# Altium schematic sheet eth_10base-t1s_phy.SchDoc
size B
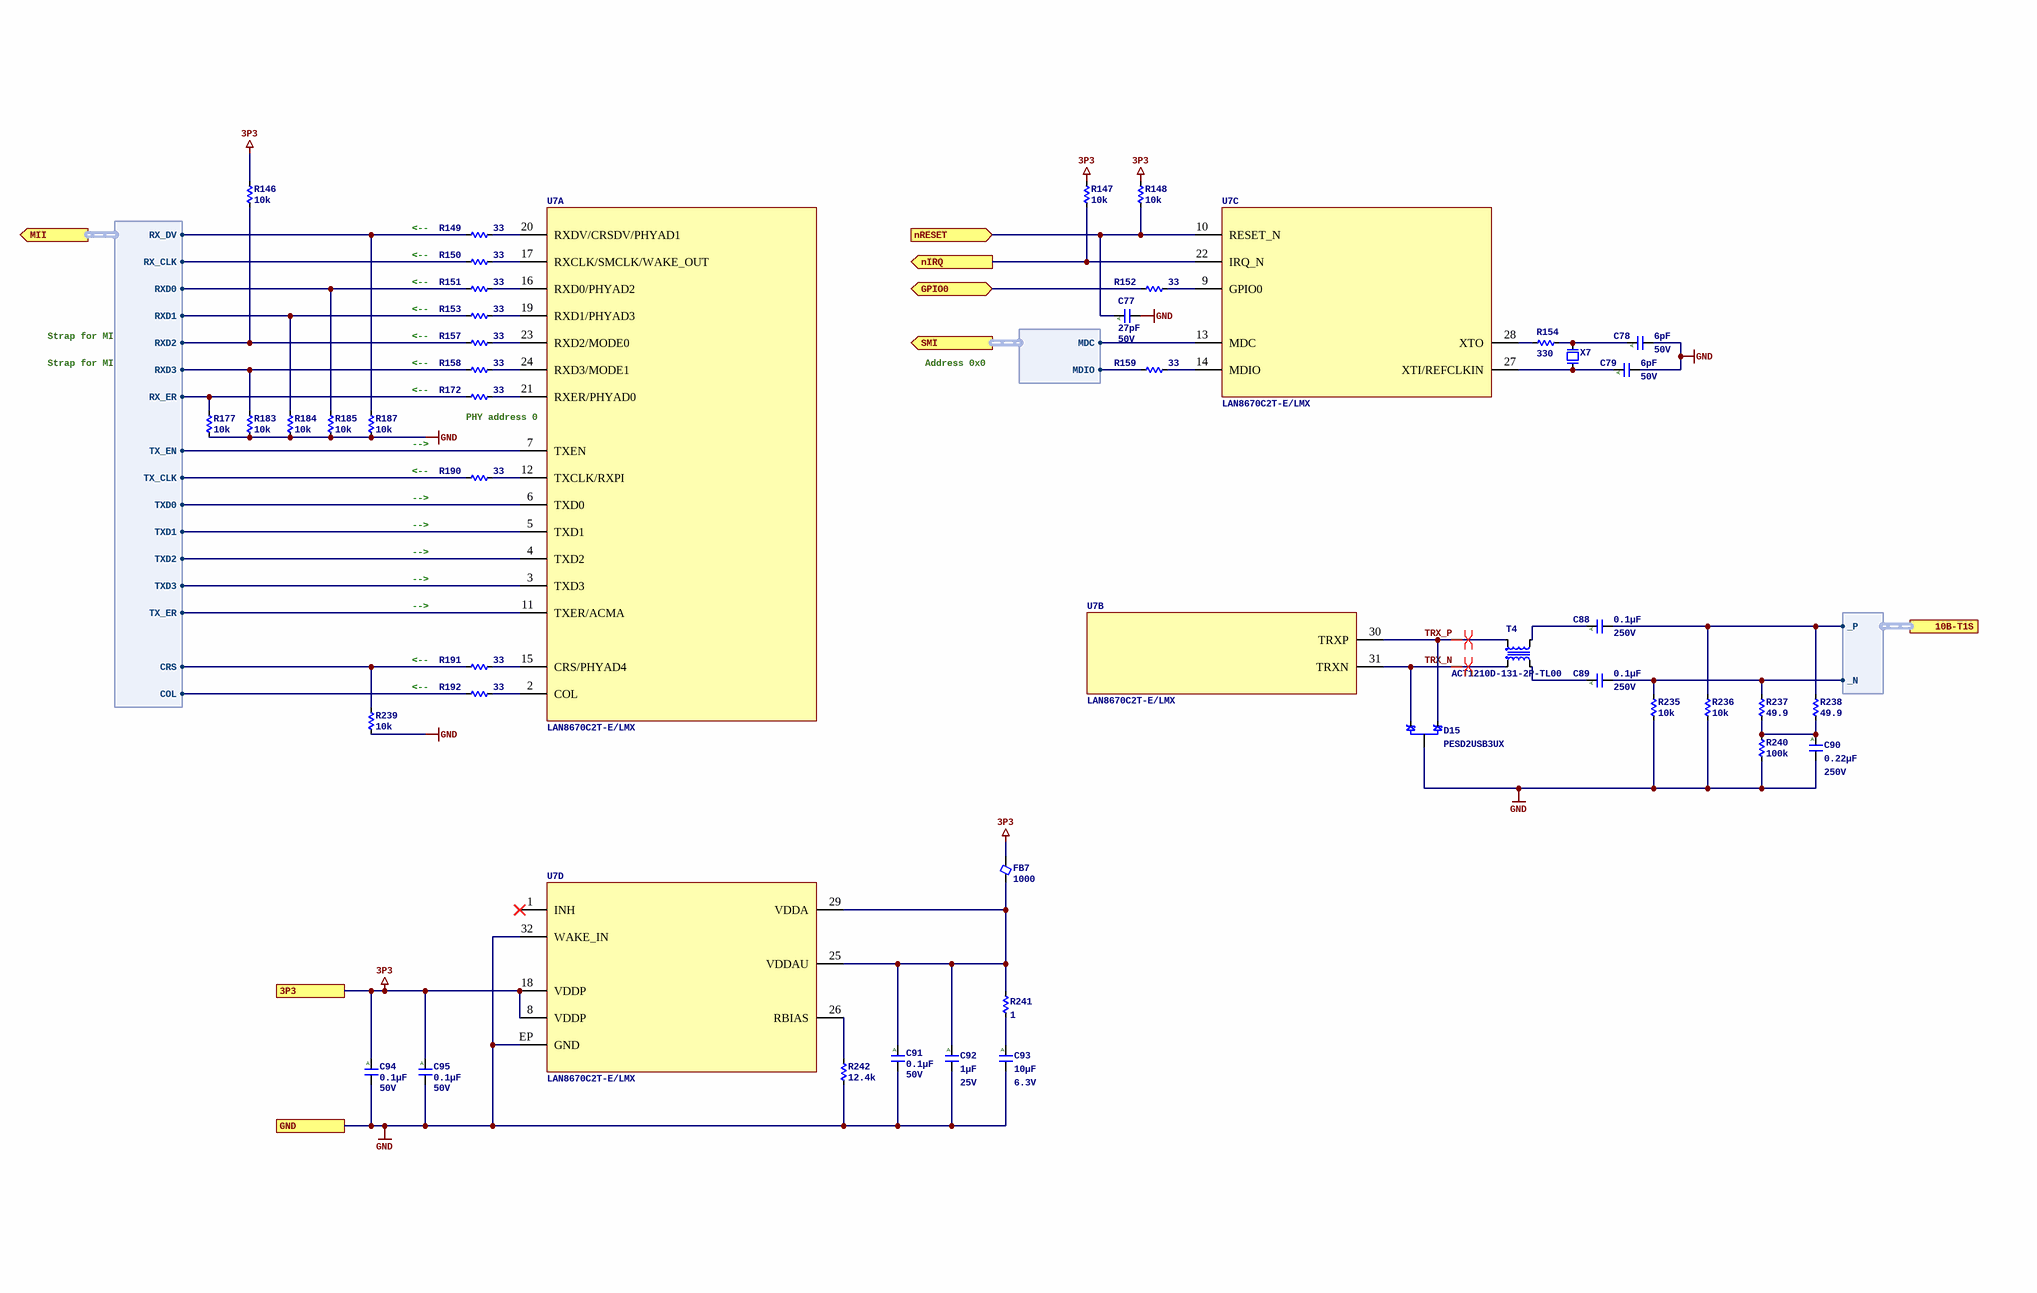
[diagram p0: eth_10base-t1s_phy.SchDoc]

## Parts
C77  Capacitance: 27pF  Voltage - Rated: 50V  [C0402_0.55MM]  (hidden comment: CGA2B2C0G1H270J050BA)
C78  Capacitance: 6pF  Voltage - Rated: 50V  [C0402_0.55MM]  (hidden comment: CGA2B2C0G1H060D050BA)
C79  Capacitance: 6pF  Voltage - Rated: 50V  [C0402_0.55MM]  (hidden comment: CGA2B2C0G1H060D050BA)
C88  Capacitance: 0.1µF  Voltage - Rated: 250V  [C1206_1.80MM]  (hidden comment: CGA5L3X7R2E104K160AA)
C89  Capacitance: 0.1µF  Voltage - Rated: 250V  [C1206_1.80MM]  (hidden comment: CGA5L3X7R2E104K160AA)
C90  Capacitance: 0.22µF  Voltage - Rated: 250V  [C1210_2.20MM]  (hidden comment: CGA6M3X7R2E224K200AA)
C91  Capacitance: 0.1µF  Voltage - Rated: 50V  [C0402_0.55MM]  (hidden comment: CGA2B3X7R1H104M050BB)
C92  Capacitance: 1µF  Voltage - Rated: 25V  [C0603_0.80MM]  (hidden comment: CGJ3E1X7R1E105K080AC)
C93  Capacitance: 10µF  Voltage - Rated: 6.3V  [C0805_1.45MM]  (hidden comment: CGA4J1X7R0J106M125AC)
C94  Capacitance: 0.1µF  Voltage - Rated: 50V  [C0402_0.55MM]  (hidden comment: CGA2B3X7R1H104M050BB)
C95  Capacitance: 0.1µF  Voltage - Rated: 50V  [C0402_0.55MM]  (hidden comment: CGA2B3X7R1H104M050BB)
D15  PESD2USB3UX  [3SOT23]
FB7  Impedance (Ohms @ 100MHz): 1000  [FB0805_1.05MM]  (hidden comment: MPZ2012S102AT000)
R146  Resistance: 10k  [R0402_0.40MM]  (hidden comment: ERJ-2RKF1002X)
R147  Resistance: 10k  [R0402_0.40MM]  (hidden comment: ERJ-2RKF1002X)
R148  Resistance: 10k  [R0402_0.40MM]  (hidden comment: ERJ-2RKF1002X)
R149  Resistance: 33  [R0402_0.40MM]  (hidden comment: ERJ-2RKF33R0X)
R150  Resistance: 33  [R0402_0.40MM]  (hidden comment: ERJ-2RKF33R0X)
R151  Resistance: 33  [R0402_0.40MM]  (hidden comment: ERJ-2RKF33R0X)
R152  Resistance: 33  [R0402_0.40MM]  (hidden comment: ERJ-2RKF33R0X)
R153  Resistance: 33  [R0402_0.40MM]  (hidden comment: ERJ-2RKF33R0X)
R154  Resistance: 330  [R0402_0.40MM]  (hidden comment: ERJ-PA2F3300X)
R157  Resistance: 33  [R0402_0.40MM]  (hidden comment: ERJ-2RKF33R0X)
R158  Resistance: 33  [R0402_0.40MM]  (hidden comment: ERJ-2RKF33R0X)
R159  Resistance: 33  [R0402_0.40MM]  (hidden comment: ERJ-2RKF33R0X)
R172  Resistance: 33  [R0402_0.40MM]  (hidden comment: ERJ-2RKF33R0X)
R177  Resistance: 10k  [R0402_0.40MM]  (hidden comment: ERJ-2RKF1002X)
R183  Resistance: 10k  [R0402_0.40MM]  (hidden comment: ERJ-2RKF1002X)
R184  Resistance: 10k  [R0402_0.40MM]  (hidden comment: ERJ-2RKF1002X)
R185  Resistance: 10k  [R0402_0.40MM]  (hidden comment: ERJ-2RKF1002X)
R187  Resistance: 10k  [R0402_0.40MM]  (hidden comment: ERJ-2RKF1002X)
R190  Resistance: 33  [R0402_0.40MM]  (hidden comment: ERJ-2RKF33R0X)
R191  Resistance: 33  [R0402_0.40MM]  (hidden comment: ERJ-2RKF33R0X)
R192  Resistance: 33  [R0402_0.40MM]  (hidden comment: ERJ-2RKF33R0X)
R235  Resistance: 10k  [R1206_0.70MM]  (hidden comment: ERJ-8ENF1002V)
R236  Resistance: 10k  [R1206_0.70MM]  (hidden comment: ERJ-8ENF1002V)
R237  Resistance: 49.9  [R1206_0.70MM]  (hidden comment: ERJ-8ENF49R9V)
R238  Resistance: 49.9  [R1206_0.70MM]  (hidden comment: ERJ-8ENF49R9V)
R239  Resistance: 10k  [R0402_0.40MM]  (hidden comment: ERJ-2RKF1002X)
R240  Resistance: 100k  [R1206_0.70MM]  (hidden comment: ERJ-8ENF1003V)
R241  Resistance: 1  [R0402_0.40MM]  (hidden comment: ERJ-2BQF1R0X)
R242  Resistance: 12.4k  [R0402_0.40MM]  (hidden comment: ERJ-2RKF1242X)
T4  ACT1210D-131-2P-TL00  [CHOKE_ACT1210D-131-2P-TL00]
U7  LAN8670C2T-E/LMX  [QFN50P500X500X90-32N]  (parts A,B,C,D of 4)
X7  XTAL_XRCGB25M000F3A00R0  [4_SMD_2.0X1.6MM]  (value not drawn)

## Ports
3P3, 10B-T1S (harness DIFF), GND, GPIO0 (bidir), MII (out, harness MII), nIRQ (out), nRESET (in), SMI (out, harness SMI)

## Harnesses
MII: RXD0, RXD1, TX_EN, TXD0, TXD1, RXD2, RXD3, TXD2, TXD3, TX_ER, TX_CLK, CRS, COL, RX_ER, RX_DV, RX_CLK
SMI: MDC, MDIO
DIFF: _N, _P

## Nets
3P3: C94.1 C95.1 FB7.2 R146.1 R147.1 R148.1 U7.8(VDDP) U7.18(VDDP) ; port 3P3
GND: C77.2 C78.2 C79.2 C90.2 C91.2 C92.2 C93.2 C94.2 C95.2 D15.3 R177.2 R183.2 R184.2 R185.2 R187.2 R235.2 R236.2 R239.2 R240.2 R242.2 U7.32(WAKE_IN) U7.EP(GND) ; port GND
GPIO0: R152.2 ; port GPIO0
nIRQ: R147.2 U7.22(IRQ_N) ; port nIRQ
nRESET: C77.1 R148.2 U7.10(RESET_N) ; port nRESET
TRX_N: D15.1 T4.2 U7.31(TRXN)
TRX_P: D15.2 T4.1 U7.30(TRXP)
NetC78_1: C78.1 R154.2 X7.3
NetC79_1: C79.1 U7.27(XTI/REFCLKIN) X7.1
NetC88_1: C88.1 T4.4
NetC88_2: C88.2 R236.1 R238.1 ; port 10B-T1S._P
NetC89_1: C89.1 T4.3
NetC89_2: C89.2 R235.1 R237.1 ; port 10B-T1S._N
NetC90_1: C90.1 R237.2 R238.2 R240.1
NetC91_1: C91.1 C92.1 FB7.1 R241.2 U7.25(VDDAU) U7.29(VDDA)
NetC93_1: C93.1 R241.1
NetR146_2: R146.2 R157.2 ; port MII.RXD2
NetR149_1: R149.1 U7.20(RXDV/CRSDV/PHYAD1)
NetR149_2: R149.2 R187.1 ; port MII.RX_DV
NetR150_1: R150.1 U7.17(RXCLK/SMCLK/WAKE_OUT)
NetR150_2: R150.2 ; port MII.RX_CLK
NetR151_1: R151.1 U7.16(RXD0/PHYAD2)
NetR151_2: R151.2 R185.1 ; port MII.RXD0
NetR152_1: R152.1 U7.9(GPIO0)
NetR153_1: R153.1 U7.19(RXD1/PHYAD3)
NetR153_2: R153.2 R184.1 ; port MII.RXD1
NetR154_1: R154.1 U7.28(XTO)
NetR157_1: R157.1 U7.23(RXD2/MODE0)
NetR158_1: R158.1 U7.24(RXD3/MODE1)
NetR158_2: R158.2 R183.1 ; port MII.RXD3
NetR159_1: R159.1 U7.14(MDIO)
NetR159_2: R159.2 ; port SMI.MDIO
NetR172_1: R172.1 U7.21(RXER/PHYAD0)
NetR172_2: R172.2 R177.1 ; port MII.RX_ER
NetR190_1: R190.1 U7.12(TXCLK/RXPI)
NetR190_2: R190.2 ; port MII.TX_CLK
NetR191_1: R191.1 U7.15(CRS/PHYAD4)
NetR191_2: R191.2 R239.1 ; port MII.CRS
NetR192_1: R192.1 U7.2(COL)
NetR192_2: R192.2 ; port MII.COL
NetR242_1: R242.1 U7.26(RBIAS)
NetU7_3: U7.3(TXD3) ; port MII.TXD3
NetU7_4: U7.4(TXD2) ; port MII.TXD2
NetU7_5: U7.5(TXD1) ; port MII.TXD1
NetU7_6: U7.6(TXD0) ; port MII.TXD0
NetU7_7: U7.7(TXEN) ; port MII.TX_EN
NetU7_11: U7.11(TXER/ACMA) ; port MII.TX_ER
NetU7_13: U7.13(MDC) ; port SMI.MDC

Not connected (* = marked no-connect by the designer): U7 1(INH)*

## Layout directives
differential pair; differential pair class DE_100: TRX_N, TRX_P

## Notes on the sheet
- <--
- Strap for MII
- Address 0x0
- (near R187) <--
- PHY address 0
- -->
- (near R187) -->
- (near R239) <--
- (in symbol CGA2B2C0G1H060D050BA) A
- (in symbol CGA2B2C0G1H270J050BA) A
- (in symbol CGA2B3X7R1H104M050BB) A
- (in symbol CGA4J1X7R0J106M125AC) A
- (in symbol CGA5L3X7R2E104K160AA) A
- (in symbol CGA6M3X7R2E224K200AA) A
- (in symbol CGJ3E1X7R1E105K080AC) A

## Library data of the parts
C77 = CGA2B2C0G1H270J050BA: CAP CER 27PF 50V C0G 0402; Manufacturer: TDK Corporation; Unit Price (USD): 0.1; Tolerance: ±5%; Temperature Coefficient: C0G, NP0; ComponentLink1URL: https://product.tdk.com/info/en/catalog/datasheets/mlcc_automotive_general_en.pdf?ref_disty=digikey; ComponentLink1Description: Series Datasheet; Series: CGA; Part Status: Active; Operating Temperature: -55°C ~ 125°C; Applications: AEC-Q200; Mounting Type: Surface Mount, MLCC; Package / Case: 0402 (1005 Metric); Size / Dimension: 0.039" L x 0.020" W (1.00mm x 0.50mm); Thickness (Max): 0.022" (0.55mm); Supplier 1: Digikey; Supplier Part Number 1: 445-5589-1-ND; Manufacturer Part Number: CGA2B2C0G1H270J050BA
C78 C79 = CGA2B2C0G1H060D050BA: CAP CER 6PF 50V C0G 0402; Manufacturer: TDK Corporation; Unit Price (USD): 0.1; Tolerance: ±0.5pF; Temperature Coefficient: C0G, NP0; ComponentLink1URL: https://product.tdk.com/info/en/catalog/datasheets/mlcc_automotive_general_en.pdf?ref_disty=digikey; ComponentLink1Description: Series Datasheet; Supplier 1: Digikey; Supplier Part Number 1: 445-5579-1-ND; Series: CGA; Part Status: Active; Operating Temperature: -55°C ~ 125°C; Applications: AEC-Q200; Mounting Type: Surface Mount, MLCC; Package / Case: 0402 (1005 Metric); Size / Dimension: 0.039" L x 0.020" W (1.00mm x 0.50mm); Thickness (Max): 0.022" (0.55mm); Manufacturer Part Number: CGA2B2C0G1H060D050BA
C88 C89 = CGA5L3X7R2E104K160AA: CAP CER 0.1UF 250V X7R 1206; Manufacturer: TDK Corporation; Unit Price (USD): 0.43; Tolerance: ±10%; ComponentLink1URL: https://product.tdk.com/info/en/catalog/datasheets/mlcc_automotive_midvoltage_en.pdf?ref_disty=digikey; ComponentLink1Description: Series Datasheet; Supplier 1: Digikey; Supplier Part Number 1: 445-5851-1-ND; Series: CGA; Part Status: Active; Temperature Coefficient: X7R; Operating Temperature: -55°C ~ 125°C; Applications: AEC-Q200; Mounting Type: Surface Mount, MLCC; Package / Case: 1206 (3216 Metric); Size / Dimension: 0.126" L x 0.063" W (3.20mm x 1.60mm); Thickness (Max): 0.071" (1.80mm); Manufacturer Part Number: CGA5L3X7R2E104K160AA
C90 = CGA6M3X7R2E224K200AA: CAP CER 0.22UF 250V X7R 1210; Manufacturer: TDK Corporation; Unit Price (USD): 0.77; Tolerance: ±10%; ComponentLink1URL: https://product.tdk.com/info/en/catalog/datasheets/mlcc_automotive_midvoltage_en.pdf?ref_disty=digikey; ComponentLink1Description: Series Datasheet; Supplier 1: Digikey; Supplier Part Number 1: 445-5869-1-ND; Series: CGA; Part Status: Active; Temperature Coefficient: X7R; Operating Temperature: -55°C ~ 125°C; Applications: AEC-Q200; Mounting Type: Surface Mount, MLCC; Package / Case: 1210 (3225 Metric); Size / Dimension: 0.126" L x 0.098" W (3.20mm x 2.50mm); Thickness (Max): 0.087" (2.20mm); Manufacturer Part Number: CGA6M3X7R2E224K200AA
C91 C94 C95 = CGA2B3X7R1H104M050BB: CAP CER 0.1UF 50V X7R 0402; Manufacturer: TDK Corporation; Unit Price (USD): 0.17; Tolerance: ±20%; ComponentLink1URL: https://product.tdk.com/info/en/catalog/datasheets/mlcc_automotive_general_en.pdf?ref_disty=digikey; ComponentLink1Description: Series Datasheet; Series: CGA; Part Status: Active; Temperature Coefficient: X7R; Operating Temperature: -55°C ~ 125°C; Applications: AEC-Q200; Mounting Type: Surface Mount, MLCC; Package / Case: 0402 (1005 Metric); Size / Dimension: 0.039" L x 0.020" W (1.00mm x 0.50mm); Thickness (Max): 0.022" (0.55mm); Supplier 1: Digikey; Supplier Part Number 1: 445-12271-1-ND; Manufacturer Part Number: CGA2B3X7R1H104M050BB
C92 = CGJ3E1X7R1E105K080AC: CAP CER 1UF 25V X7R 0603; Manufacturer: TDK Corporation; Unit Price (USD): 0.55; Tolerance: ±10%; ComponentLink1URL: https://product.tdk.com/info/en/catalog/datasheets/mlcc_highreliability_general_en.pdf?ref_disty=digikey; ComponentLink1Description: Series Datasheet; Series: CGJ; Part Status: Active; Temperature Coefficient: X7R; Operating Temperature: -55°C ~ 125°C; Applications: AEC-Q200; Mounting Type: Surface Mount, MLCC; Package / Case: 0603 (1608 Metric); Size / Dimension: 0.063" L x 0.031" W (1.60mm x 0.80mm); Thickness (Max): 0.031" (0.80mm); Supplier 1: Digikey; Supplier Part Number 1: 445-13311-1-ND; Manufacturer Part Number: CGJ3E1X7R1E105K080AC
C93 = CGA4J1X7R0J106M125AC: CAP CER 10UF 6.3V X7R 0805; Manufacturer: TDK Corporation; Unit Price (USD): 0.43; Tolerance: ±20%; ComponentLink1URL: https://product.tdk.com/info/en/catalog/datasheets/mlcc_automotive_general_en.pdf?ref_disty=digikey; ComponentLink1Description: Series Datasheet; Series: CGA; Part Status: Active; Temperature Coefficient: X7R; Operating Temperature: -55°C ~ 125°C; Applications: AEC-Q200; Mounting Type: Surface Mount, MLCC; Package / Case: 0805 (2012 Metric); Size / Dimension: 0.079" L x 0.049" W (2.00mm x 1.25mm); Thickness (Max): 0.057" (1.45mm); Supplier 1: Digikey; Supplier Part Number 1: 445-12776-1-ND; Manufacturer Part Number: CGA4J1X7R0J106M125AC
D15 = TVS_PESD2USB3UX-T: DIODE ESD USB SOT-23; Manufacturer: Nexperia USA Inc.; Supplier 1: Digikey; Supplier Part Number 1: 1727-PESD2USB3UX-CT-ND; Manufacturer Part Number: PESD2USB3UX; Supplier 2: LCSC; Supplier Part Number 2: C3708426; ComponentLink1Description: Datasheet; ComponentLink1URL: https://assets.nexperia.com/documents/data-sheet/PESD2USB3UX-T.pdf
FB7 = MPZ2012S102AT000: FERRITE BEAD 1 KOHM 0805 1LN; Manufacturer: TDK Corporation; Filter Type: Power Line; Current Rating (Max): 1.5A; DC Resistance (DCR) (Max): 150mOhm; ComponentLink1URL: https://product.tdk.com/info/en/catalog/datasheets/beads_commercial_power_mpz2012_en.pdf; ComponentLink1Description: Datasheet; Series: MPZ; Part Status: Active; Operating Temperature: -55°C ~ 125°C; Package / Case: 0805 (2012 Metric); Mounting Type: Surface Mount; Height (Max): 0.041" (1.05mm); Size / Dimension: 0.079" L x 0.049" W (2.00mm x 1.25mm); Supplier Part Number 1: 445-5223-1-ND; Supplier 1: Digikey; Manufacturer Part Number: MPZ2012S102AT000; Supplier 2: LCSC; Supplier Part Number 2: C76817
R146-R148 R177 R183-R185 R187 R239 = ERJ-2RKF1002X: RES SMD 10K OHM 1% 1/10W 0402; Manufacturer: Panasonic Electronic Components; Unit Price (USD): 0.1; Power (Watts): 0.1W, 1/10W; Temperature Coefficient: ±100ppm/°C; ComponentLink1Description: Datasheet; ComponentLink1URL: https://industrial.panasonic.com/cdbs/www-data/pdf/RDA0000/AOA0000C304.pdf; Series: ERJ; Tolerance: ±1%; Composition: Thick Film; Features: Automotive AEC-Q200; Operating Temperature: -55°C ~ 155°C; Package / Case: 0402 (1005 Metric); Supplier Device Package: 0402; Size / Dimension: 0.039" L x 0.020" W (1.00mm x 0.50mm); Height - Seated (Max): 0.016" (0.40mm); Supplier 1: Digikey; Supplier Part Number 1: P10.0KLCT-ND; Manufacturer Part Number: ERJ-2RKF1002X
R149-R153 R157-R159 R172 R190-R192 = ERJ-2RKF33R0X: RES SMD 33 OHM 1% 1/10W 0402; Manufacturer: Panasonic Electronic Components; Unit Price (USD): 0.1; Power (Watts): 0.1W, 1/10W; Temperature Coefficient: ±100ppm/°C; ComponentLink1Description: Datasheet; ComponentLink1URL: https://industrial.panasonic.com/cdbs/www-data/pdf/RDA0000/AOA0000C304.pdf; Series: ERJ; Tolerance: ±1%; Composition: Thick Film; Features: Automotive AEC-Q200; Operating Temperature: -55°C ~ 155°C; Package / Case: 0402 (1005 Metric); Supplier Device Package: 0402; Size / Dimension: 0.039" L x 0.020" W (1.00mm x 0.50mm); Height - Seated (Max): 0.016" (0.40mm); Supplier 1: Digikey; Supplier Part Number 1: P33.0LCT-ND; Manufacturer Part Number: ERJ-2RKF33R0X
R154 = ERJ-PA2F3300X: RES SMD 330 OHM 1% 1/5W 0402; Manufacturer: Panasonic Electronic Components; Unit Price (USD): 0.21; Power (Watts): 0.2W, 1/5W; Temperature Coefficient: ±100ppm/°C; ComponentLink1Description: Datasheet; ComponentLink1URL: https://industrial.panasonic.com/cdbs/www-data/pdf/RDO0000/AOA0000C331.pdf; Series: ERJ; Tolerance: ±1%; Composition: Thick Film; Features: Automotive AEC-Q200, Pulse Withstanding; Operating Temperature: -55°C ~ 155°C; Package / Case: 0402 (1005 Metric); Supplier Device Package: 0402; Size / Dimension: 0.039" L x 0.020" W (1.00mm x 0.50mm); Height - Seated (Max): 0.016" (0.40mm); Supplier 1: Digikey; Supplier Part Number 1: P17221CT-ND; Manufacturer Part Number: ERJ-PA2F3300X
R235 R236 = ERJ-8ENF1002V: RES SMD 10K OHM 1% 1/4W 1206; Manufacturer: Panasonic Electronic Components; Unit Price (USD): 0.1; Power (Watts): 0.25W, 1/4W; Temperature Coefficient: ±100ppm/°C; ComponentLink1Description: Datasheet; ComponentLink1URL: https://industrial.panasonic.com/cdbs/www-data/pdf/RDA0000/AOA0000C304.pdf; Series: ERJ; Tolerance: ±1%; Composition: Thick Film; Features: Automotive AEC-Q200; Operating Temperature: -55°C ~ 155°C; Package / Case: 1206 (3216 Metric); Supplier Device Package: 1206; Size / Dimension: 0.126" L x 0.063" W (3.20mm x 1.60mm); Height - Seated (Max): 0.028" (0.70mm); Supplier 1: Digikey; Supplier Part Number 1: P10.0KFCT-ND; Manufacturer Part Number: ERJ-8ENF1002V
R237 R238 = ERJ-8ENF49R9V: RES SMD 49.9 OHM 1% 1/4W 1206; Manufacturer: Panasonic Electronic Components; Unit Price (USD): 0.1; Power (Watts): 0.25W, 1/4W; Temperature Coefficient: ±100ppm/°C; ComponentLink1Description: Datasheet; ComponentLink1URL: https://industrial.panasonic.com/cdbs/www-data/pdf/RDA0000/AOA0000C304.pdf; Series: ERJ; Tolerance: ±1%; Composition: Thick Film; Features: Automotive AEC-Q200; Operating Temperature: -55°C ~ 155°C; Package / Case: 1206 (3216 Metric); Supplier Device Package: 1206; Size / Dimension: 0.126" L x 0.063" W (3.20mm x 1.60mm); Height - Seated (Max): 0.028" (0.70mm); Supplier 1: Digikey; Supplier Part Number 1: P49.9FCT-ND; Manufacturer Part Number: ERJ-8ENF49R9V
R240 = ERJ-8ENF1003V: RES SMD 100K OHM 1% 1/4W 1206; Manufacturer: Panasonic Electronic Components; Unit Price (USD): 0.1; Power (Watts): 0.25W, 1/4W; Temperature Coefficient: ±100ppm/°C; ComponentLink1Description: Datasheet; ComponentLink1URL: https://industrial.panasonic.com/cdbs/www-data/pdf/RDA0000/AOA0000C304.pdf; Series: ERJ; Tolerance: ±1%; Composition: Thick Film; Features: Automotive AEC-Q200; Operating Temperature: -55°C ~ 155°C; Package / Case: 1206 (3216 Metric); Supplier Device Package: 1206; Size / Dimension: 0.126" L x 0.063" W (3.20mm x 1.60mm); Height - Seated (Max): 0.028" (0.70mm); Supplier 1: Digikey; Supplier Part Number 1: P100KFCT-ND; Manufacturer Part Number: ERJ-8ENF1003V
R241 = ERJ-2BQF1R0X: RES SMD 1 OHM 1% 1/6W 0402; Manufacturer: Panasonic Electronic Components; Unit Price (USD): 0.41; Power (Watts): 0.167W, 1/6W; Temperature Coefficient: ±250ppm/°C; ComponentLink1Description: Datasheet; ComponentLink1URL: https://industrial.panasonic.com/cdbs/www-data/pdf/RDN0000/AOA0000C313.pdf; Series: ERJ; Tolerance: ±1%; Composition: Thick Film; Features: Automotive AEC-Q200, Current Sense; Operating Temperature: -55°C ~ 125°C; Package / Case: 0402 (1005 Metric); Supplier Device Package: 0402; Size / Dimension: 0.039" L x 0.020" W (1.00mm x 0.50mm); Height - Seated (Max): 0.016" (0.40mm); Supplier 1: Digikey; Supplier Part Number 1: P17252CT-ND; Manufacturer Part Number: ERJ-2BQF1R0X
R242 = ERJ-2RKF1242X: RES SMD 12.4K OHM 1% 1/10W 0402; Manufacturer: Panasonic Electronic Components; Unit Price (USD): 0.1; Power (Watts): 0.1W, 1/10W; Temperature Coefficient: ±100ppm/°C; ComponentLink1Description: Datasheet; ComponentLink1URL: https://industrial.panasonic.com/cdbs/www-data/pdf/RDA0000/AOA0000C304.pdf; Series: ERJ; Tolerance: ±1%; Composition: Thick Film; Features: Automotive AEC-Q200; Operating Temperature: -55°C ~ 155°C; Package / Case: 0402 (1005 Metric); Supplier Device Package: 0402; Size / Dimension: 0.039" L x 0.020" W (1.00mm x 0.50mm); Height - Seated (Max): 0.016" (0.40mm); Supplier 1: Digikey; Supplier Part Number 1: P12.4KLCT-ND; Manufacturer Part Number: ERJ-2RKF1242X
T4 = CHOKE_ACT1210D-131-2P-TL00: 130 µH @ 100 kHz 2 Line Common Mode Choke Surface Mount 6.7 kOhms @ 10 MHz 115mA DCR 3.5Ohm; Manufacturer: TDK Corporation; Supplier 1: Digikey; ComponentLink1URL: https://product.tdk.com/system/files/dam/doc/product/emc/emc/cmf_cmc/catalog/cmf_automotive_signal_act1210d_en.pdf; ComponentLink1Description: Datasheet; Supplier Part Number 1: 445-ACT1210D-131-2P-TL00CT-ND; Manufacturer Part Number: ACT1210D-131-2P-TL00; Supplier 2: LCSC; Supplier Part Number 2: C5547342
U7 = ETH_PHY_LAN8670C2T-E/LMX: 10BASE-T1S PHY WITH MII/RMII "1/1 Transceiver Full, Half Ethernet 32-VQFN (5x5)"; Manufacturer: Microchip; Supplier 1: DigiKey; Supplier Part Number 1: 150-LAN8670C2T-E/LMXCT-ND; Manufacturer Part Number: LAN8670C2T-E/LMX; ComponentLink1Description: Datasheet; ComponentLink1URL: https://ww1.microchip.com/downloads/aemDocuments/documents/AIS/ProductDocuments/DataSheets/LAN8670-1-2-Data-Sheet-60001573.pdf; Supplier 2: LCSC; Supplier Part Number 2: C20901523
X7 = XTAL_XRCGB25M000F3A00R0: CRYSTAL 25.000MHZ 6PF SMD; Manufacturer: Murata; Supplier 1: Digikey; Supplier Part Number 1: 490-12146-2-ND; Manufacturer Part Number: XRCGB25M000F3A00R0; Supplier 2: LCSC; Supplier Part Number 2: C467842; ComponentLink1Description: Datasheet; ComponentLink1URL: https://www.murata.com/products/productdata/8801076543518/SPEC-XRCGB25M000F3A00R0.pdf